# EAGLE design IFM_DuberFilter_ThroughHole_PCB_REV1 (EAGLE 9.5.1)
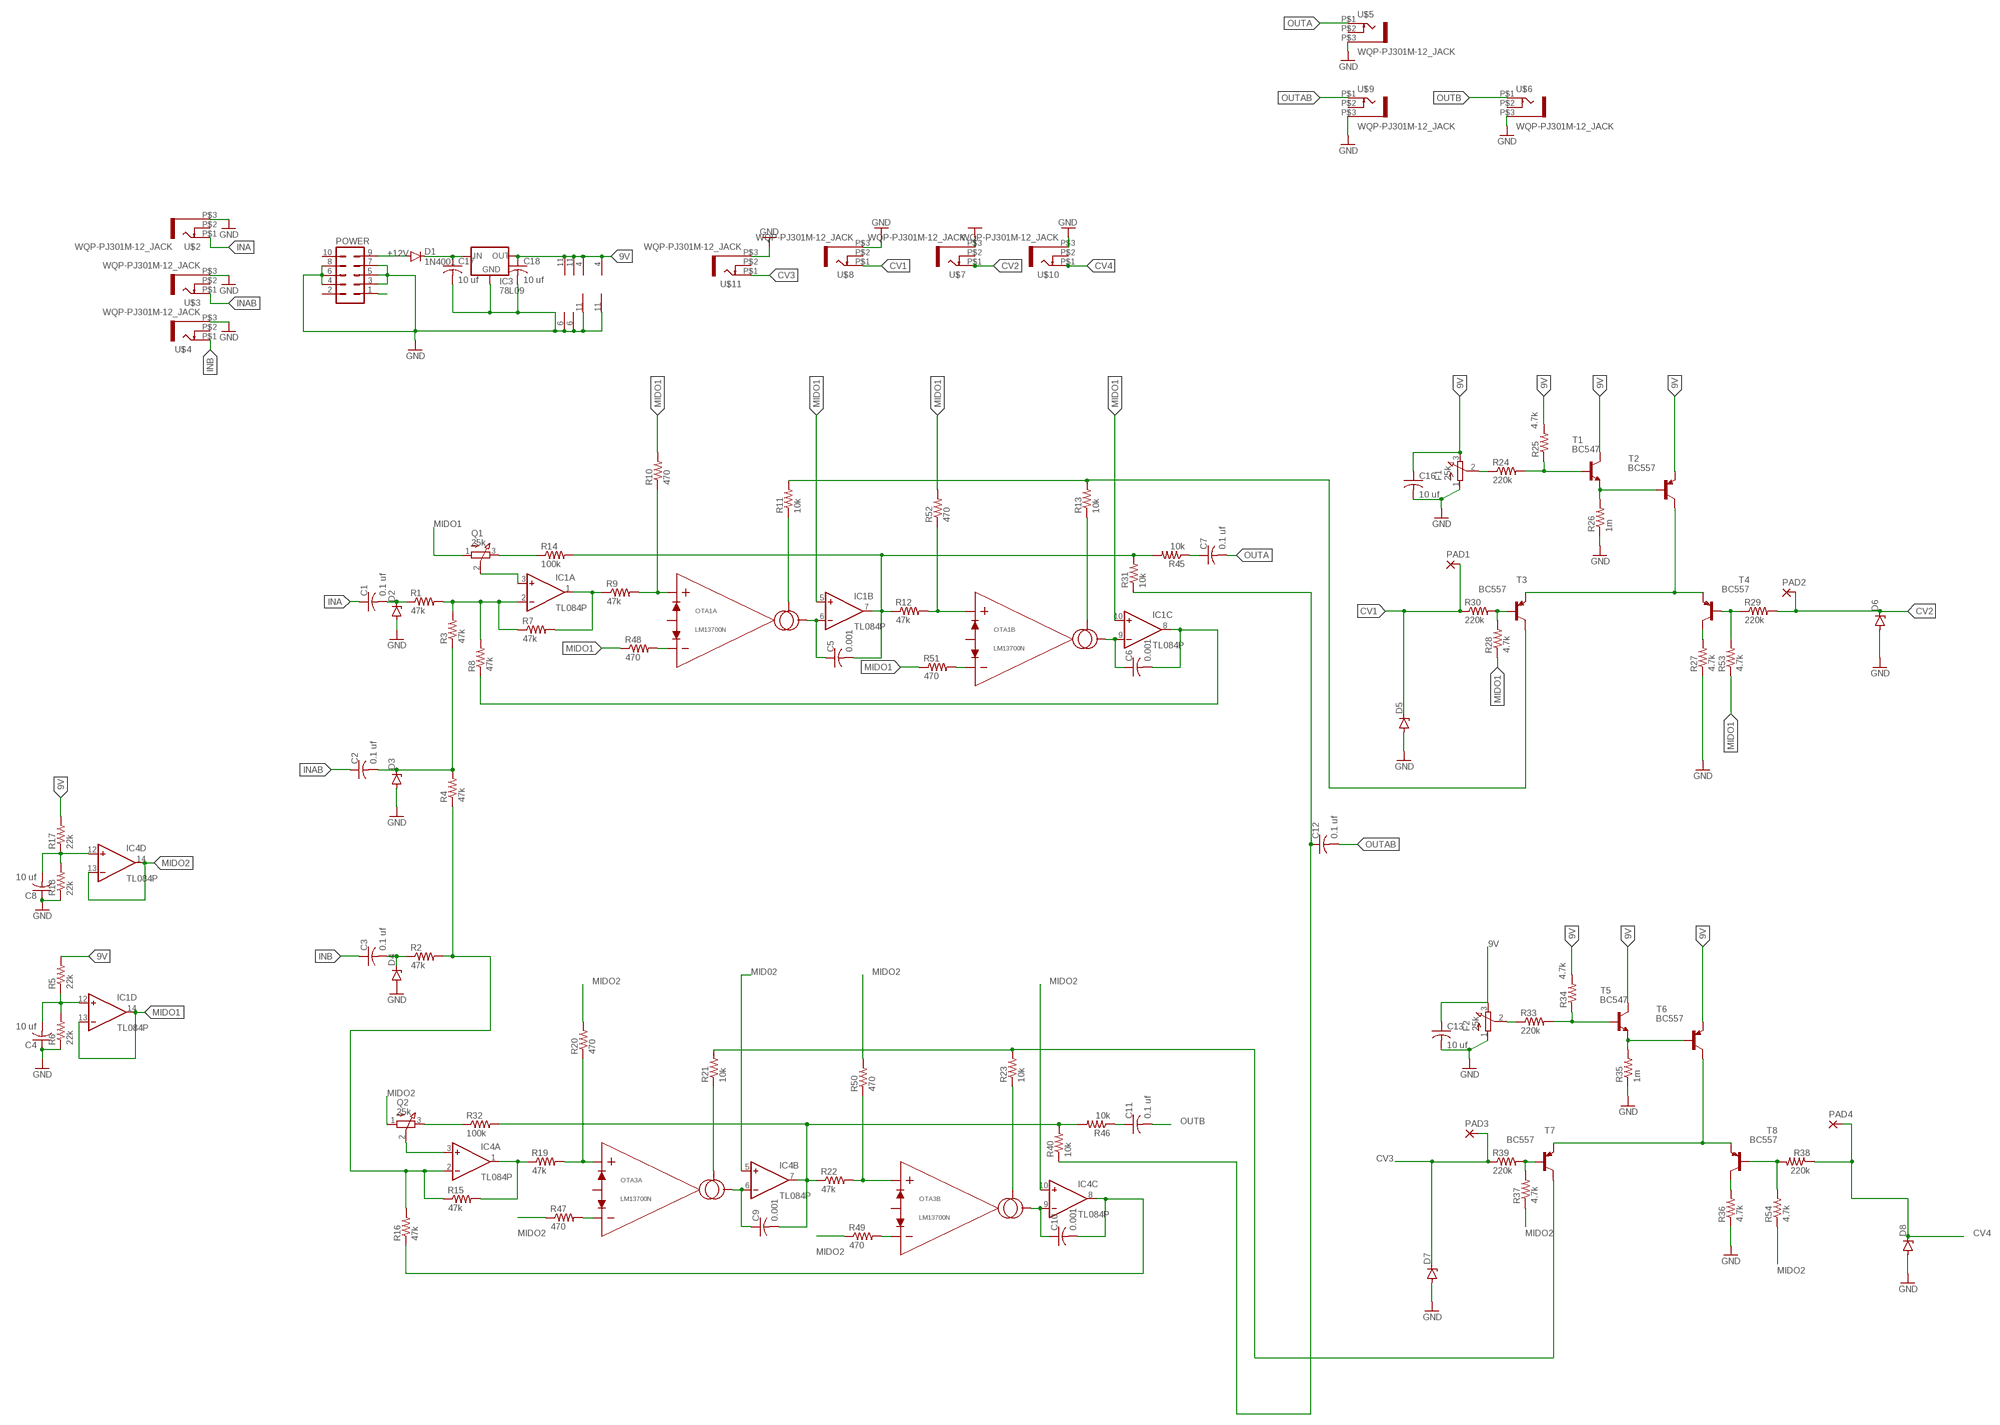
[diagram p0: schematic, sheet 1]

## Parts
C1  0.1 uf  C-US050-030X075  [C050-030X075]
C2  0.1 uf  C-US050-030X075  [C050-030X075]
C3  0.1 uf  C-US050-030X075  [C050-030X075]
C4  10 uf  C-US050-030X075  [C050-030X075]
C5  0.001  C-US050-030X075  [C050-030X075]
C6  0.001  C-US050-030X075  [C050-030X075]
C7  0.1 uf  C-US050-030X075  [C050-030X075]
C8  10 uf  C-US050-030X075  [C050-030X075]
C9  0.001  C-US050-030X075  [C050-030X075]
C10  0.001  C-US050-030X075  [C050-030X075]
C11  0.1 uf  C-US050-030X075  [C050-030X075]
C12  0.1 uf  C-US050-030X075  [C050-030X075]
C13  10 uf  C-US050-030X075  [C050-030X075]
C16  10 uf  C-US050-030X075  [C050-030X075]
C17  10 uf  C-US050-030X075  [C050-030X075]
C18  10 uf  C-US050-030X075  [C050-030X075]
D1  1N4001  1N4004  [DO41-10]
D2  ZENER-DIODEDO34-7  [DO34Z7]
D3  ZENER-DIODEDO34-7  [DO34Z7]
D4  ZENER-DIODEDO34-7  [DO34Z7]
D5  ZENER-DIODEDO34-7  [DO34Z7]
D6  ZENER-DIODEDO34-7  [DO34Z7]
D7  ZENER-DIODEDO34-7  [DO34Z7]
D8  ZENER-DIODEDO34-7  [DO34Z7]
F1  25k  EVUF3L  [EVUFXL]
F2  25k  EVUF3L  [EVUFXL]
IC1  TL084P  [DIL14]
IC3  78L09  78LXX  [78LXX]
IC4  TL084P  [DIL14]
OTA1  LM13700N  [DIP16]
OTA3  LM13700N  [DIP16]
PAD1  SMD2  [SMD1,27-2,54]
PAD2  SMD2  [SMD1,27-2,54]
PAD3  SMD2  [SMD1,27-2,54]
PAD4  SMD2  [SMD1,27-2,54]
POWER  10_PIN_HEADER  [MA05-2]
Q1  25k  EVUF3L  [EVUFXL]
Q2  25k  EVUF3L  [EVUFXL]
R1  47k  R-US_0204/7  [0204/7]
R2  47k  R-US_0204/7  [0204/7]
R3  47k  R-US_0204/7  [0204/7]
R4  47k  R-US_0204/7  [0204/7]
R5  22k  R-US_0204/7  [0204/7]
R6  22k  R-US_0204/7  [0204/7]
R7  47k  R-US_0204/7  [0204/7]
R8  47k  R-US_0204/7  [0204/7]
R9  47k  R-US_0204/7  [0204/7]
R10  470  R-US_0204/7  [0204/7]
R11  10k  R-US_0204/7  [0204/7]
R12  47k  R-US_0204/7  [0204/7]
R13  10k  R-US_0204/7  [0204/7]
R14  100k  R-US_0204/7  [0204/7]
R15  47k  R-US_0204/7  [0204/7]
R16  47k  R-US_0204/7  [0204/7]
R17  22k  R-US_0204/7  [0204/7]
R18  22k  R-US_0204/7  [0204/7]
R19  47k  R-US_0204/7  [0204/7]
R20  470  R-US_0204/7  [0204/7]
R21  10k  R-US_0204/7  [0204/7]
R22  47k  R-US_0204/7  [0204/7]
R23  10k  R-US_0204/7  [0204/7]
R24  220k  R-US_0204/7  [0204/7]
R25  4.7k  R-US_0204/7  [0204/7]
R26  1m  R-US_0204/7  [0204/7]
R27  4.7k  R-US_0204/7  [0204/7]
R28  4.7k  R-US_0204/7  [0204/7]
R29  220k  R-US_0204/7  [0204/7]
R30  220k  R-US_0204/7  [0204/7]
R31  10k  R-US_0204/7  [0204/7]
R32  100k  R-US_0204/7  [0204/7]
R33  220k  R-US_0204/7  [0204/7]
R34  4.7k  R-US_0204/7  [0204/7]
R35  1m  R-US_0204/7  [0204/7]
R36  4.7k  R-US_0204/7  [0204/7]
R37  4.7k  R-US_0204/7  [0204/7]
R38  220k  R-US_0204/7  [0204/7]
R39  220k  R-US_0204/7  [0204/7]
R40  10k  R-US_0204/7  [0204/7]
R45  10k  R-US_0204/7  [0204/7]
R46  10k  R-US_0204/7  [0204/7]
R47  470  R-US_0204/7  [0204/7]
R48  470  R-US_0204/7  [0204/7]
R49  470  R-US_0204/7  [0204/7]
R50  470  R-US_0204/7  [0204/7]
R51  470  R-US_0204/7  [0204/7]
R52  470  R-US_0204/7  [0204/7]
R53  4.7k  R-US_0204/7  [0204/7]
R54  4.7k  R-US_0204/7  [0204/7]
T1  BC547  [TO92]
T2  BC557  BC557A-PNP-TO92-EBC  [TO92-EBC]
T3  BC557  BC557A-PNP-TO92-EBC  [TO92-EBC]
T4  BC557  BC557A-PNP-TO92-EBC  [TO92-EBC]
T5  BC547  [TO92]
T6  BC557  BC557A-PNP-TO92-EBC  [TO92-EBC]
T7  BC557  BC557A-PNP-TO92-EBC  [TO92-EBC]
T8  BC557  BC557A-PNP-TO92-EBC  [TO92-EBC]
U$2  WQP-PJ301M-12_JACK  [WQP-PJ301M-12_JACK]
U$3  WQP-PJ301M-12_JACK  [WQP-PJ301M-12_JACK]
U$4  WQP-PJ301M-12_JACK  [WQP-PJ301M-12_JACK]
U$5  WQP-PJ301M-12_JACK  [WQP-PJ301M-12_JACK]
U$6  WQP-PJ301M-12_JACK  [WQP-PJ301M-12_JACK]
U$7  WQP-PJ301M-12_JACK  [WQP-PJ301M-12_JACK]
U$8  WQP-PJ301M-12_JACK  [WQP-PJ301M-12_JACK]
U$9  WQP-PJ301M-12_JACK  [WQP-PJ301M-12_JACK]
U$10  WQP-PJ301M-12_JACK  [WQP-PJ301M-12_JACK]
U$11  WQP-PJ301M-12_JACK  [WQP-PJ301M-12_JACK]

## Nets
9V: C13.1 C16.1 C18.1 F1.3(E) F2.3(E) IC1.4(P:V+) IC3.OUT IC4.4(P:V+) OTA1.11(PWR:VCC) OTA3.11(PWR:VCC) R5.2 R17.2 R25.2 R34.2 T1.3(C) T2.E T5.3(C) T6.E
+12V [power]: C17.1 D1.C IC3.IN
-12V [power]: POWER.1
CV1: D5.C PAD1.1(P) R30.1 U$8.P$1
CV2: D6.C PAD2.1(P) R29.2 U$7.P$1
CV3: D7.C PAD3.1(P) R39.1 U$11.P$1
CV4: D8.C PAD4.1(P) R38.1 U$10.P$1
GND: C4.1 C8.1 C13.2 C16.2 C17.2 C18.2 D2.A D3.A D4.A D5.A D6.A D7.A D8.A F1.1(A) F2.1(A) IC1.11(P:V-) IC3.GND IC4.11(P:V-) OTA1.6(PWR:VEE) OTA3.6(PWR:VEE) POWER.3 POWER.4 POWER.5 POWER.6 POWER.7 POWER.8 R6.1 R18.1 R26.1 R27.1 R35.1 R36.1 U$2.P$3 U$3.P$3 U$4.P$3 U$5.P$3 U$6.P$3 U$7.P$3 U$8.P$3 U$9.P$3 U$10.P$3 U$11.P$3
INA: C1.1 U$2.P$1
INAB: C2.1 U$3.P$1
INB: C3.1 U$4.P$1
MID02: IC4.5(B:+IN)
MIDO1: IC1.5(B:+IN) IC1.10(C:+IN) IC1.13(D:-IN) IC1.14(D:OUT) Q1.1(A) R10.2 R28.1 R48.1 R51.1 R52.2 R53.1
MIDO2: IC4.10(C:+IN) IC4.13(D:-IN) IC4.14(D:OUT) Q2.1(A) R20.2 R37.1 R47.1 R49.1 R50.2 R54.1
N$1: C3.2 D4.C R2.1
N$2: C1.2 D2.C R1.1
N$3: C2.2 D3.C R3.1 R4.2
N$4: IC4.2(A:-IN) R2.2 R4.1 R15.1 R16.2
N$5: IC1.2(A:-IN) R1.2 R3.2 R7.1 R8.2
N$6: OTA1.16(B:IABC) R13.1
N$7: C4.2 IC1.12(D:+IN) R5.1 R6.2
N$8: Q1.3(E) R14.1
N$9: OTA1.13(B:IN-) R51.2
N$10: IC4.1(A:OUT) R15.2 R19.1
N$11: IC1.1(A:OUT) R7.2 R9.1
N$12: OTA1.3(A:IN+) R9.2 R10.1
N$13: C5.1 IC1.6(B:-IN) OTA1.5(A:IOUT)
N$14: OTA1.1(A:IABC) R11.1
N$15: C5.2 IC1.7(B:OUT) R12.1 R14.2 R31.2 R45.2
N$16: R29.1 R53.2 T4.B
N$17: R11.2 R13.2 T3.C
N$18: C6.1 IC1.9(C:-IN) OTA1.12(B:IOUT)
N$19: C6.2 IC1.8(C:OUT) R8.1
N$20: IC1.3(A:+IN) Q1.2(S)
N$21: F1.2(S) R24.1
N$22: OTA1.14(B:IN+) R12.2 R52.1
N$23: OTA3.3(A:IN+) R19.2 R20.1
N$24: C8.2 IC4.12(D:+IN) R17.1 R18.2
N$25: C9.1 IC4.6(B:-IN) OTA3.5(A:IOUT)
N$26: OTA3.1(A:IABC) R21.1
N$27: C9.2 IC4.7(B:OUT) R22.1 R32.2 R40.2 R46.2
N$28: OTA3.16(B:IABC) R23.1
N$29: R21.2 R23.2 T7.C
N$30: Q2.3(E) R32.1
N$31: C10.1 IC4.9(C:-IN) OTA3.12(B:IOUT)
N$32: C10.2 IC4.8(C:OUT) R16.1
N$33: D1.A POWER.9
N$34: IC4.3(A:+IN) Q2.2(S)
N$35: OTA1.4(A:IN-) R48.2
N$36: R33.2 R34.1 T5.2(B)
N$37: F2.2(S) R33.1
N$38: R24.2 R25.1 T1.2(B)
N$40: R26.2 T1.1(E) T2.B
N$41: T2.C T3.E T4.E
N$42: R35.2 T5.1(E) T6.B
N$43: R27.2 T4.C
N$44: C12.1 R31.1 R40.1
N$45: R28.2 R30.2 T3.B
N$47: C11.1 R46.1
N$50: T6.C T7.E T8.E
N$51: R36.2 T8.C
N$52: R38.2 R54.2 T8.B
N$53: R37.2 R39.2 T7.B
N$55: OTA3.4(A:IN-) R47.2
N$56: OTA3.13(B:IN-) R49.2
N$57: OTA3.14(B:IN+) R22.2 R50.1
N$66: C7.1 R45.1
OUTA: C7.2 U$5.P$1
OUTAB: C12.2 U$9.P$1
OUTB: C11.2 U$6.P$1
Unconnected: OTA1.2(A:BIAS) OTA1.7(BUFA:IN) OTA1.8(BUFA:OUT) OTA1.9(BUFB:OUT) OTA1.10(BUFB:IN) OTA1.15(B:BIAS) OTA3.2(A:BIAS) OTA3.7(BUFA:IN) OTA3.8(BUFA:OUT) OTA3.9(BUFB:OUT) OTA3.10(BUFB:IN) OTA3.15(B:BIAS) POWER.2 POWER.10 U$2.P$2 U$3.P$2 U$4.P$2 U$5.P$2 U$6.P$2 U$7.P$2 U$8.P$2 U$9.P$2 U$10.P$2 U$11.P$2

## Library data of the parts
C1-C13 C16-C18 = rcl:C-US: CAPACITOR, American symbol; SPICEPREFIX: C
D1 = diode:1N4004: DIODE general purpose rectifier, 1 A
D2 D4-D8 = diode:ZENER-DIODE: Z-Diode
D3 = diode:ZENER-DIODE: Z-Diode; SPICEPREFIX: D
F1 F2 Q1 Q2 = pot:EVU: 9 mm Square Rotary Potentiometers Source: Panasonic
IC1 IC4 = linear:TL084: OP AMP
IC3 = v-reg:78LXX: VOLTAGE REGULATOR
OTA1 OTA3 = OTAs:LM13700: Dual OTA with linearizing diode and output buffers - 2MHz open-loop bandwidth - Linearizing diodes reduces distortion at higher differential input voltages - Darlington output buffers enables low-impedance output LM13700 or LM13600 The LM13700 differs from the LM13600 in that the 13700's output buffers are biased independently from the transconductance amplifier, allowing superior performance in audio applications. Originally released by National Semiconductor Manufactured by Texas Instruments.
PAD1-PAD4 = wirepad:SMD2: SMD PAD
POWER = TomW:10_PIN_HEADER: PIN HEADER; OC_FARNELL: unknown; OC_NEWARK: unknown
R1-R40 R45-R54 = rcl:R-US_: RESISTOR, American symbol; SPICEPREFIX: R
T1 T5 = transistor:BC547: NPN TRANSISTOR
T2-T4 T6-T8 = transistor:*-PNP-: PNP Transistror
U$2-U$11 = thonkiconn:WQP-PJ301M-12_JACK

## Net classes
1 power: width 0.61 mm

## Board
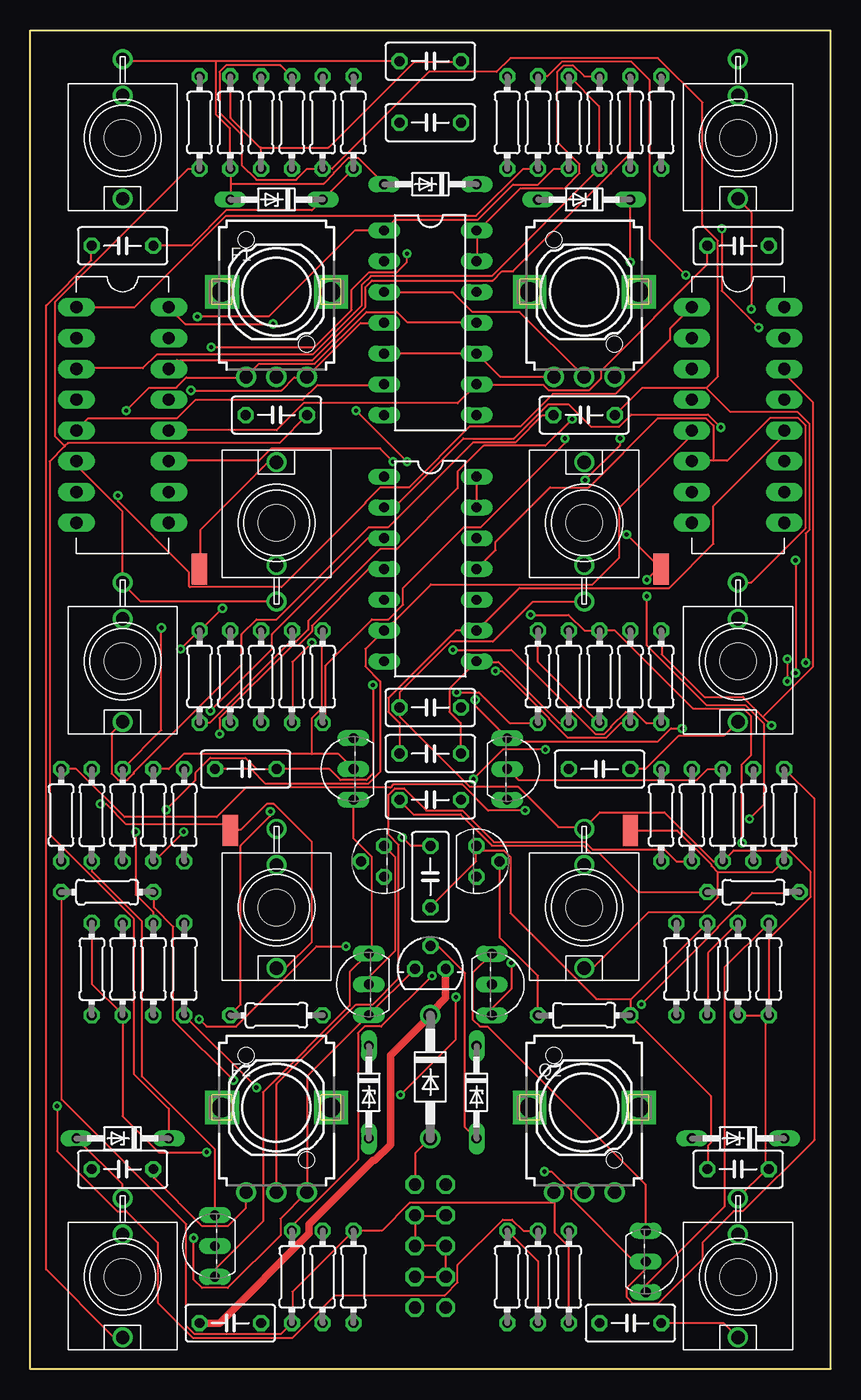
[diagram p1: board, top side]
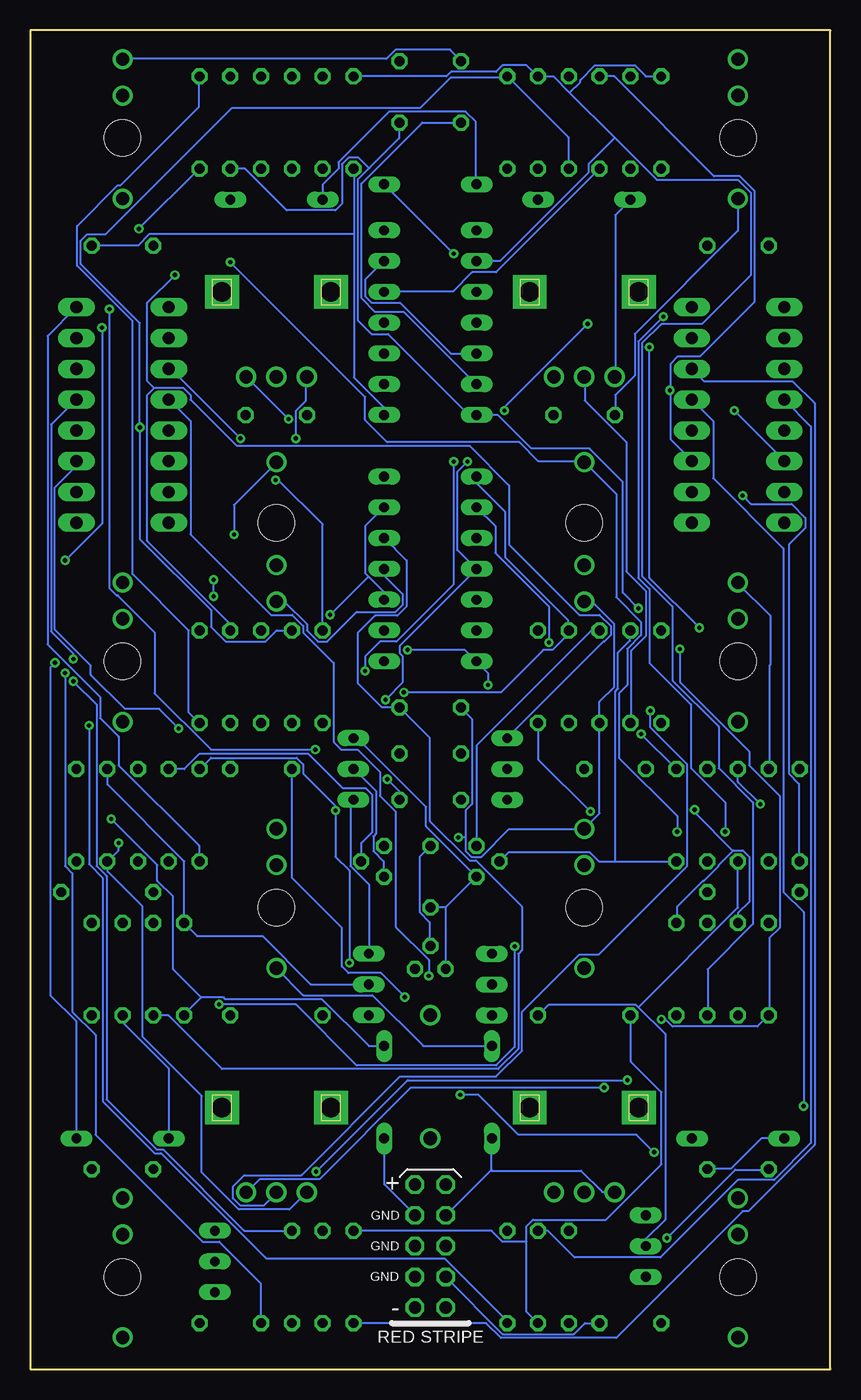
[diagram p2: board, bottom side, seen from below]

Size 66.04 x 110.49 mm. Coordinates in mm from the lower left corner, seen from the top.
Outline: 0,110.49 66.04,110.49 66.04,0 0,0 0,110.49
Copper layers (1*16): Top 0.035mm / dielectric 1.5mm / Bottom 0.035mm
Design rules "default": minimum track width 6mil, minimum drill 0.35mm, track to track 6mil, track to pad 6mil, pad to pad 6mil, via to via 6mil, smd to smd 6mil, copper to edge 40mil, drill to drill 6mil, minimum pad ring 10mil, minimum via ring 8mil, stop-mask expansion 4mil, vias tented up to drill 0mil, thermal gap 10mil
Holes 3 mm at 7.62,101.6 20.32,69.85 7.62,7.62 7.62,58.42 20.32,38.1 45.72,69.85 45.72,38.1 58.42,7.62 58.42,58.42 58.42,101.6

### Footprints (pad centres in the part's own frame; a part is rotated, then mirrored left to right if it is on the bottom)
C050-030X075 = drill 0.813 octagon: 1 -2.54,0; 2 2.54,0
DO41-10 = drill 1.118: A 5.08,0; C -5.08,0
DO34Z7 = drill 0.813 long: A 3.81,0; C -3.81,0
EVUFXL = drill 1.1 pad 1.676: 1 -2.5,-7; 2 0,-7; 3 2.5,-7 | drill 1.6 pad 2.8 square: M1 4.5,0; M2 -4.5,0
DIL14 = drill 0.813 long: 1 -7.62,-3.81; 2 -5.08,-3.81; 3 -2.54,-3.81; 4 0,-3.81; 5 2.54,-3.81; 6 5.08,-3.81; 7 7.62,-3.81; 8 7.62,3.81; 9 5.08,3.81; 10 2.54,3.81; 11 0,3.81; 12 -2.54,3.81; 13 -5.08,3.81; 14 -7.62,3.81
78LXX = drill 0.813 octagon: GND 0,1.905; IN 1.27,0; OUT -1.27,0
DIP16 = drill 1 long: 1 -3.81,0; 2 -3.81,-2.54; 3 -3.81,-5.08; 4 -3.81,-7.62; 5 -3.81,-10.16; 6 -3.81,-12.7; 7 -3.81,-15.24; 8 -3.81,-17.78; 9 3.81,-17.78; 10 3.81,-15.24; 11 3.81,-12.7; 12 3.81,-10.16; 13 3.81,-7.62; 14 3.81,-5.08; 15 3.81,-2.54; 16 3.81,0
SMD1,27-2,54 = smd 1.27 x 2.54: 1 0,0
MA05-2 = drill 1.016 octagon: 1 -5.08,-1.27; 2 -5.08,1.27; 3 -2.54,-1.27; 4 -2.54,1.27; 5 0,-1.27; 6 0,1.27; 7 2.54,-1.27; 8 2.54,1.27; 9 5.08,-1.27; 10 5.08,1.27
0204/7 = drill 0.813 octagon: 1 -3.81,0; 2 3.81,0
TO92 = drill 0.813 octagon: 1 1.27,0; 2 0,1.905; 3 -1.27,0
TO92-EBC = drill 0.813 long: B 0,-1.27; C 2.54,-1.27; E -2.54,-1.27
WQP-PJ301M-12_JACK = drill 1.1: P$1 0,5; P$2 0,-3.5; P$3 0,-6.5

### Placement (x,y rotation side)
C1  20.32,78.74 0 top
C2  45.72,78.74 0 top
C3  7.62,92.71 0 top
C4  33.02,107.95 0 top
C5  33.02,102.87 0 top
C6  58.42,92.71 0 top
C7  33.02,46.99 0 top
C8  33.02,54.61 0 top
C9  17.78,49.53 0 top
C10  33.02,50.8 0 top
C11  49.53,3.81 0 top
C12  46.99,49.53 0 top
C13  58.42,16.51 0 top
C16  7.62,16.51 0 top
C17  16.51,3.81 0 top
C18  33.02,40.64 90 top
D1  33.02,24.13 270 top
D2  7.62,19.05 180 top
D3  58.42,19.05 180 top
D4  20.32,96.52 180 top
D5  45.72,96.52 180 top
D6  33.02,97.79 180 top
D7  36.83,22.86 270 top
D8  27.94,22.86 270 top
F1  20.32,88.9 0 top
F2  20.32,21.59 0 top
IC1  33.02,86.36 270 top
IC3  33.02,33.02 0 top
IC4  33.02,66.04 270 top
OTA1  7.62,87.63 0 top
OTA3  58.42,87.63 0 top
PAD1  13.97,66.04 0 top
PAD2  16.51,44.45 0 top
PAD3  52.07,66.04 0 top
PAD4  49.53,44.45 0 top
POWER  33.02,10.16 90 bottom
Q1  45.72,88.9 0 top
Q2  45.72,21.59 0 top
R1  13.97,102.87 90 top
R2  26.67,102.87 90 top
R3  24.13,102.87 90 top
R4  21.59,102.87 90 top
R5  19.05,102.87 90 top
R6  16.51,102.87 90 top
R7  10.16,33.02 90 top
R8  39.37,102.87 90 top
R9  44.45,102.87 90 top
R10  46.99,102.87 90 top
R11  41.91,102.87 90 top
R12  49.53,102.87 90 top
R13  49.53,57.15 90 top
R14  13.97,57.15 90 top
R15  21.59,57.15 90 top
R16  44.45,57.15 90 top
R17  55.88,33.02 90 top
R18  58.42,33.02 90 top
R19  41.91,57.15 90 top
R20  46.99,57.15 90 top
R21  2.54,45.72 90 top
R22  52.07,57.15 90 top
R23  52.07,45.72 90 top
R24  16.51,57.15 90 top
R25  12.7,45.72 90 top
R26  19.05,57.15 90 top
R27  5.08,45.72 270 top
R28  24.13,57.15 90 top
R29  7.62,45.72 90 top
R30  10.16,45.72 90 top
R31  5.08,33.02 270 top
R32  12.7,33.02 90 top
R33  54.61,45.72 90 top
R34  45.72,29.21 0 top
R35  57.15,45.72 90 top
R36  60.96,33.02 90 top
R37  59.69,45.72 90 top
R38  62.23,45.72 90 top
R39  53.34,33.02 90 top
R40  7.62,33.02 90 top
R45  59.69,39.37 0 top
R46  52.07,102.87 90 top
R47  21.59,7.62 90 top
R48  24.13,7.62 90 top
R49  44.45,7.62 90 top
R50  26.67,7.62 90 top
R51  41.91,7.62 90 top
R52  39.37,7.62 90 top
R53  20.32,29.21 0 top
R54  6.35,39.37 0 top
T1  29.21,41.91 90 top
T2  26.67,31.75 90 top
T3  25.4,49.53 90 top
T4  13.97,10.16 90 top
T5  36.83,41.91 270 top
T6  40.64,49.53 270 top
T7  39.37,31.75 270 top
T8  52.07,8.89 270 top
U$2  7.62,101.6 180 top
U$3  7.62,58.42 180 top
U$4  7.62,7.62 180 top
U$5  58.42,101.6 180 top
U$6  58.42,7.62 180 top
U$7  20.32,38.1 180 top
U$8  20.32,69.85 0 top
U$9  58.42,58.42 180 top
U$10  45.72,38.1 180 top
U$11  45.72,69.85 0 top

### Tracks (layer width: path | path; a pad name or v marks a point on that pad's centre or on a via)
9V  (via drill 0.35)
  Top 0.152: IC1.4 29.18,86.33 27.28,86.33 22.86,81.92 F1.3 22.78,81.84 21.79,81.84 20.73,80.77 v13.26,80.77 | v15.62,52.43 15.62,53.72 21.64,59.74 22.1,59.74 23.24,60.88 23.24,61.34 27.89,65.99 29.18,65.99 IC4.4 | R17.2 49.57,30.52 | 49.57,30.52 49.53,30.48 R34.2 49.53,29.18 56.16,22.55 56.16,18.67 55.93,18.44 55.93,16.54 C13.1 | v13.49,10.82 13.49,7.39 14.17,6.71 16.31,6.71 20.65,11.05 20.65,12.42 22.78,14.55 F2.3 22.86,14.63 22.86,24.16 27.89,29.18 T2.E 27.96,29.26 31.7,32.99 IC3.OUT | 36.8,42.82 36.8,41.91 32.99,38.1 C18.1 | 36.8,42.82 36.8,43.13 T5.3 36.8,42.82 | v53.8,52.88 52.88,52.88 51.82,51.82 39.62,51.82 T6.E 36.73,54.71 v36.73,55.24 | 36.8,42.82 39.09,42.82 39.62,42.29 39.62,37.64 46.71,30.56 49.53,30.56 49.57,30.52 | v29.95,74.91 28.88,75.97 19.89,75.97 18.9,74.98 11.43,74.98 OTA1.11
  Bottom 0.152: R5.2 17.83,106.68 9.6,98.45 7.47,98.45 6.25,97.23 6.25,88.09 10.74,83.59 12.57,83.59 13.18,82.98 13.18,80.77 | 13.18,80.77 13.18,76.73 11.43,74.98 OTA1.11 | 13.18,80.77 v13.26,80.77 | v15.62,52.43 12.72,49.53 R25.2 | v13.49,10.82 7.85,16.46 5.11,16.46 C16.1 | 31.77,38.1 C18.1 | 31.77,38.1 29.26,40.62 T1.3 33.38,44.81 33.38,46.41 39.01,52.05 39.32,52.05 T6.E | v53.8,52.88 55.4,54.48 58.22,54.48 61.04,57.3 61.04,58.06 64.01,61.04 64.01,72.77 62.26,74.52 62.26,74.91 OTA3.11 | 31.77,38.1 31.77,33.07 IC3.OUT | v36.73,55.24 35.28,56.69 35.28,58.83 35.51,59.05 35.51,59.74 IC4.4 29.26,66.06 30.79,67.59 30.79,74.07 v29.95,74.91
+12V
  Top 0.61: C17.1 15.62,3.81 23.01,11.2 23.01,11.96 28.27,17.22 28.42,17.22 29.72,18.52 29.72,25.91 D1.C 33.15,29.49 34.29,30.63 IC3.IN
CV1  (via drill 0.35)
  Top 0.152: PAD1.1 14.02,66.06 14.02,69.27 19.58,74.83 20.27,74.83 U$8.P$1 | v12.65,44.35 10.21,41.91 R30.1 | v49.53,91.36 D5.C
  Bottom 0.152: v12.65,44.35 12.65,45.64 17.45,50.44 17.45,55.78 16.76,56.46 16.76,59.44 15.62,60.58 15.62,61.65 17.68,63.7 17.68,72.24 20.27,74.83 U$8.P$1 20.34,74.91 24.08,74.91 25.68,76.5 36.58,76.5 38.41,78.33 38.41,80.24 v49.53,91.36
CV2  (via drill 0.35)
  Top 0.152: U$7.P$1 20.34,33.15 21.11,33.15 23.24,35.28 23.24,43.51 20.12,46.63 19.51,46.63 17.37,44.5 16.54,44.5 PAD2.1 16,44.96 7.92,44.96 6.25,46.63 v5.79,46.63 | v31.09,92.05 31.09,91.36 30.25,90.53 27.96,90.53 26.52,89.08 26.52,87.4 23.47,84.35 v14.94,84.35 | v10.82,61.19 10.82,52.73 R29.2
  Bottom 0.152: R29.2 7.62,48.46 v5.79,46.63 | v31.09,92.05 D6.C | v14.94,84.35 14.94,65.3 v10.82,61.19
CV3  (via drill 0.35)
  Top 0.152: v49.23,68.89 PAD3.1 51.89,66.14 v50.9,65.15 | v50.9,63.78 50.9,59.74 55.85,54.79 59.05,54.79 60.58,53.26 60.58,46.63 v59.36,45.41
  Bottom 0.152: v49.23,68.89 49.23,71.32 45.72,74.83 U$11.P$1 | D7.C 38.1,26.67 41.99,30.56 49.99,30.56 50.14,30.71 51.89,30.71 51.93,30.67 | 51.93,30.67 53.34,29.26 R39.1 | v50.9,63.78 v50.9,65.15 | v59.36,45.41 55.55,41.6 55.55,40.31 54.25,39.01 54.25,32.99 51.93,30.67
CV4
  Top 0.152: 56.77,41 56.24,41.53 56.24,41.6 53.42,44.42 49.53,44.42 PAD4.1 | 56.77,41 61.27,41 62.18,41.91 R38.1 | 56.77,41 56.77,38.94 55.55,37.72 51.05,37.72 46.48,33.15 45.72,33.15 U$10.P$1
  Bottom 0.152: D8.C 33.6,26.67 37.8,30.86 43.51,30.86 45.72,33.07 U$10.P$1
GND  (via drill 0.35)
  Top 0.152: IC1.11 36.8,86.41 31.09,86.41 30.25,87.25 27.74,87.25 23.47,82.98 18.9,82.98 17.83,81.92 F1.1 17.75,81.84 12.88,81.84 12.04,81 9.83,81 v7.92,79.1 | 16.54,97.84 16.54,99.06 R6.1 16.46,99.06 16.46,102.41 15.32,103.56 15.32,107.97 | 16.54,97.84 16.54,96.55 D4.A | 16.54,97.84 24.23,97.84 25.07,98.68 25.07,98.75 26.29,99.97 27.05,99.97 29.18,97.84 D6.A | 15.32,107.97 7.7,107.97 7.62,108.05 U$2.P$3 | 15.32,107.97 30.48,107.97 C4.1 | IC3.GND 33.07,34.9 33.68,34.9 35.89,32.69 35.89,19.96 36.8,19.05 D7.A | POWER.3 POWER.4 POWER.6 34.29,10.21 31.85,10.21 POWER.5 31.77,10.21 31.77,12.65 POWER.7 31.85,12.65 34.29,12.65 POWER.8 | D2.A 7.62,15.24 U$4.P$3 | C16.2 10.21,16.46 10.21,15.77 14.17,11.81 16.31,11.81 17.75,13.26 17.75,14.55 F2.1 | OTA1.6 3.81,74.6 7.62,70.79 U$3.P$3 7.62,64.85 9.07,63.4 20.27,63.4 U$8.P$3 | U$6.P$3 58.45,14.17 60.73,16.46 60.96,16.46 C13.2 60.66,16.46 60.66,29.18 | 60.66,29.18 58.45,29.18 R18.1 | 60.66,29.18 60.96,29.18 R36.1 | 60.66,29.18 R36.1 | 56.39,74.98 57.53,74.98 61.04,78.49 63.4,78.49 64.01,77.88 64.01,69.42 59.51,64.92 58.45,64.92 U$9.P$3 | 56.39,74.98 54.63,74.98 OTA3.6 | U$11.P$3 45.72,63.32 41.45,63.32 38.18,60.05 34.67,60.05 30.48,55.85 C8.1 30.48,53.87 36.27,48.08 40.23,48.08 43.59,44.73 45.72,44.73 U$10.P$3 45.72,44.65 47.02,45.95 52.35,45.95 56.39,41.91 R35.1 58.06,42.82 62.64,42.82 64.39,41.07 64.39,38.94 60.96,35.51 R36.1 | 56.39,74.98 56.39,77.88 55.78,78.49 51.82,78.49 46.1,72.77 42.9,72.77 38.41,68.28 38.41,67.59 36.88,66.06 IC4.11 | v30.71,43.89 31.39,43.2 32.99,43.2 C18.2
  Bottom 0.152: D5.A 41.91,97.77 40.62,99.06 40.62,99.59 36.42,103.78 30.1,103.78 29.26,102.95 29.26,97.84 D6.A | F1.1 17.75,81.92 17.75,95.25 16.54,96.47 D4.A | U$5.P$3 58.37,108.13 36.65,108.13 35.89,108.89 31.39,108.89 30.48,107.97 C4.1 | C18.2 33.91,42.29 33.91,37.72 33.07,36.88 33.07,34.98 IC3.GND | D7.A 36.8,19.05 36.8,15.24 34.29,12.72 POWER.8 | C17.2 20.27,3.81 21.18,2.9 27.05,2.9 31.77,7.62 POWER.3 | D2.A 5.71,19.05 8.23,16.54 10.13,16.54 C16.2 | 28,16.42 31.7,12.72 POWER.7 | 28,16.42 27.96,16.46 27.96,19.05 D8.A | F2.1 17.83,14.63 18.82,14.63 20.57,16.38 27.96,16.38 28,16.42 | U$8.P$3 20.27,63.32 19.66,63.32 17.83,61.49 17.83,56.31 19.05,55.09 R26.1 19.05,45.87 20.27,44.65 U$7.P$3 20.34,44.58 26.52,44.58 28.8,42.29 29.64,42.29 30.1,42.75 30.1,43.89 | R27.1 5.03,49.53 5.03,58.06 4.95,58.14 4.95,62.18 7.62,64.85 U$3.P$3 | D3.A 54.63,19.05 54.63,24.84 58.37,28.57 58.37,29.18 R18.1 | IC4.11 36.8,65.99 36.8,65.46 35.28,63.93 35.28,63.09 35.89,62.48 39.09,62.48 41.53,60.05 42.29,60.05 43.2,60.96 43.2,61.49 45.03,63.32 45.72,63.32 U$11.P$3 | 30.1,43.89 30.1,46.1 29.57,46.63 29.57,53.65 30.48,54.56 C8.1 | 30.1,43.89 v30.71,43.89 | v7.92,79.1 3.81,74.98 OTA1.6
INA
  Bottom 0.152: U$2.P$1 7.62,93.95 16.15,85.42 16.15,81.99 17.75,80.39 17.75,78.79 C1.1
INAB
  Top 0.152: C2.1 43.13,78.72 42.29,78.72 40.08,76.5 36.58,76.5 29.57,69.49 27.96,69.49 20.34,61.87 18.67,61.87 17.45,60.66 17.45,58.14 8.53,49.23 8.53,49.15 8,48.62 7.24,48.62 6.71,49.15 6.71,52.5 U$3.P$1
INB
  Top 0.152: C3.1 5.03,92.66 5.03,91.52 1.29,87.78 1.29,8.23 6.86,2.67 7.62,2.67 U$4.P$1
MIDO1  (via drill 0.35)
  Top 0.152: IC1.5 IC1.10 36.88,83.82 38.79,81.92 43.2,81.92 Q1.1 | IC1.13 36.88,91.44 36.88,93.95 IC1.14 36.96,93.95 40.46,97.46 44.12,97.46 45.34,98.68 45.34,99.44 43.51,101.27 43.51,107.06 44.04,107.59 44.81,107.59 45.72,106.68 R10.2 | R51.1 41.91,8.91 39.4,11.43 R52.2 | v19.81,46.02 19.81,45.64 17.37,43.2 17.37,30.1 16.54,29.26 R53.1 | v44.12,76.81 44.12,76.43 37.19,69.49 35.81,69.49 30.79,64.47 30.79,63.09 29.57,61.87 28.19,61.87 24.38,58.06 24.38,53.57 24.16,53.34 R28.1
  Bottom 0.152: IC1.5 31.32,83.82 35.51,88.01 37.87,88.01 38.41,88.54 38.41,89.92 36.88,91.44 IC1.13 | 25.07,10.52 25.07,4.72 24.16,3.81 R48.1 | 25.07,10.52 25.07,11.81 24.54,12.34 18.52,12.34 13.95,16.92 13.95,22.86 16.46,25.38 16.46,29.18 R53.1 | v19.81,46.02 24.08,50.29 24.08,53.34 R28.1 | R52.2 27.96,11.43 27.05,10.52 25.07,10.52 | v44.12,76.81 44.12,79.1 43.28,79.93 43.28,81.84 Q1.1
MIDO2  (via drill 0.35)
  Top 0.152: R54.1 2.59,39.32 2.59,22.25 12.88,11.96 12.88,3.58 13.56,2.9 20.65,2.9 21.57,3.81 R47.1 21.64,3.81 21.64,6.4 R50.2 29.03,11.43 31.32,13.72 43.28,13.72 | v41.3,62.26 44.42,62.26 45.72,60.96 R20.2 48.23,60.96 54.71,54.48 58.9,54.48 59.51,53.87 59.51,50.67 58.75,49.91 v58.75,43.43 | IC4.14 36.88,73.61 36.88,71.17 IC4.13 | 43.28,13.72 43.28,14.55 Q2.1 | 43.28,13.72 43.28,11.28 44.42,10.13 44.42,3.81 R49.1
  Bottom 0.152: 38.14,65.42 38.41,65.68 38.41,69.57 36.88,71.09 IC4.13 | 38.14,65.42 36.88,64.16 36.88,63.55 IC4.10 | 38.14,65.42 v41.3,62.26 | 59.66,41.91 59.66,41.07 56.77,38.18 56.77,27.43 51.89,22.55 51.89,16.23 48.84,13.18 44.65,13.18 43.28,14.55 Q2.1 | v58.75,43.43 58.75,42.82 59.66,41.91 | 59.66,41.91 R37.1
N$1
  Top 0.152: C3.2 10.21,92.73 13.26,92.73 16.15,95.63 23.24,95.63 D4.C R2.1
N$2
  Top 0.152: D2.C 11.43,21.49 8.53,24.38 8.53,37.19 1.6,44.12 1.6,74.91 2.86,76.16 | 2.86,76.16 3.12,76.43 20.57,76.43 22.86,78.72 C1.2 | R1.1 13.03,99.06 2.06,88.09 2.06,76.96 2.86,76.16
N$3  (via drill 0.35)
  Top 0.152: R4.2 21.57,106.68 20.65,107.59 16.15,107.59 15.62,107.06 15.62,103.71 17.45,101.88 17.45,99.36 18.67,98.15 21.95,98.15 22.86,99.06 R3.1 24.92,99.06 32.92,107.06 38.48,107.06 39.62,108.2 51.82,108.2 55.47,104.55 55.47,94.41 56.77,93.12 56.77,81.92 55.82,80.96 | v64.01,58.29 64.01,68.96 64.31,69.27 64.31,78.03 63.32,79.02 57.76,79.02 55.82,80.96 | 55.82,80.96 55.78,81 50.52,81 C2.2
  Bottom 0.152: v64.01,58.29 64.39,57.91 64.39,30.86 62.26,28.73 62.26,19.05 D3.C
N$4  (via drill 0.35)
  Top 0.152: v23.24,59.97 21.64,58.37 21.64,53.34 R15.1 | v57,77.72 55.93,78.79 49.61,78.79 48.62,77.8 46.25,77.8 44.42,79.63 42.75,79.63 39.93,76.81 35.74,76.81 30.1,71.17 29.26,71.17 IC4.2
  Bottom 0.152: R4.1 21.64,99.06 21.64,101.65 R2.2 26.67,106.6 31.32,106.6 33.83,104.09 49.38,104.09 59.82,93.65 61.34,93.65 61.87,93.12 61.87,91.21 57,86.33 v57,77.72 57,68.5 51.13,62.64 51.13,61.27 49.91,60.05 46.63,60.05 45.72,60.96 R16.2 | v23.24,59.97 23.24,62.94 27.66,67.36 27.66,69.57 IC4.2
N$5
  Bottom 0.152: 21.53,105.35 22.86,106.68 R3.2 24.16,106.68 25.07,107.59 27.05,107.59 27.58,107.06 31.32,107.06 31.7,106.68 R8.2 | 21.53,105.35 17.79,101.61 | 17.79,101.61 14.33,98.15 7.62,98.15 6.55,97.08 6.55,90.3 10.59,86.26 13.95,86.26 15.54,84.66 15.54,65.46 13.03,62.94 13.03,56.84 9.22,53.03 9.22,49.61 6.4,46.79 6.4,36.73 10.13,32.99 10.13,29.26 R7.1 | IC1.2 27.28,91.44 19.96,98.75 19.96,99.44 17.79,101.61 | R1.2 15.24,106.68 16.15,107.59 19.43,107.59 20.65,106.38 20.65,106.22 21.53,105.35
N$6  (via drill 0.35)
  Top 0.152: R13.1 48.77,53.34 47.55,52.12 44.35,52.12 42.82,53.65 42.82,53.72 38.94,57.61 v38.41,57.61 | v26.9,79.1 v31.09,74.91 | v20.04,86.26 12.8,86.26 OTA1.16
  Bottom 0.152: v38.41,57.61 38.41,58.83 37.19,60.05 35.81,60.05 31.09,64.77 v31.09,74.91 | v26.9,79.1 26.9,79.4 v20.04,86.26
N$7
  Top 0.152: 19.01,100.78 19.05,100.74 R5.1 | 19.01,100.78 16.54,103.25 16.54,106.68 R6.2 | C4.2 35.51,107.9 31.7,107.9 24.61,100.81 19.05,100.81 19.01,100.78
  Bottom 0.152: R5.1 27.58,90.53 29.57,90.53 31.17,88.92 36.8,88.92 IC1.12
N$8  (via drill 0.35)
  Top 0.152: R14.1 14.78,53.34 21.49,60.05 21.95,60.05 22.94,61.04 22.94,61.72 28.88,67.67 30.25,67.67 35.28,72.69 35.28,74.07 37.41,76.2 42.52,76.2 v44.73,78.41
  Bottom 0.152: v44.73,78.41 48.16,81.84 Q1.3
N$9  (via drill 0.35)
  Top 0.152: R51.2 40.69,11.43 39.78,12.34 39.01,12.34 35.28,8.61 35.28,7.16 34.21,6.1 25.15,6.1 21.64,2.59 13.41,2.59 10.52,5.49 10.52,10.44 7.92,13.03 7.16,13.03 2.21,17.98 v2.21,21.72
  Bottom 0.152: v2.21,21.72 2.21,37.72 3.89,39.4 3.89,67.74 9.68,73.53 9.68,78.26 OTA1.13
N$10  (via drill 0.35)
  Top 0.152: R19.1 39.55,53.34 37.03,55.85 v35.2,55.85
  Bottom 0.152: v35.2,55.85 27.2,55.85 23.7,59.36 22.94,59.36 21.64,60.66 21.64,60.96 | 21.64,60.96 21.64,61.8 26.82,66.98 26.82,70.71 29.18,73.08 29.18,73.61 IC4.1 | 21.64,60.96 R15.2
N$11  (via drill 0.35)
  Top 0.152: v8.69,44.35 8.69,39.17 10.13,37.72 10.13,36.88 R7.2 | v13.79,86.87 19.66,86.87 26.75,93.95 29.18,93.95 IC1.1 30.1,94.87 36.96,94.87 39.85,97.77 41.91,97.77 43.2,99.06 R9.1
  Bottom 0.152: v8.69,44.35 8.69,46.79 11.51,49.61 11.51,54.86 14.94,58.29 14.94,64.39 15.85,65.3 15.85,84.81 v13.79,86.87
N$12
  Top 0.152: 46.94,99.06 46.94,104.24 44.5,106.68 R9.2 | 46.94,99.06 38.1,90.22 28.12,90.22 27.36,89.46 27.36,87.78 23.32,83.74 10.44,83.74 9.3,82.6 3.81,82.6 OTA1.3 | 46.94,99.06 R10.1
N$13
  Top 0.152: IC1.6 29.18,81.23 23.7,81.23 22.48,80.01 13.64,80.01 12.12,78.49 4.8,78.49 3.81,77.5 OTA1.5
  Bottom 0.152: C5.1 33.68,102.87 38.71,97.84 38.71,88.39 37.57,87.25 35.2,87.25 29.26,81.31 IC1.6
N$14
  Top 0.152: R11.1 40.69,99.06 36.8,95.17 16.15,95.17 8.61,87.63 OTA1.1
N$15  (via drill 0.35)
  Top 0.152: v12.42,59.44 13.95,60.96 R14.2 14.02,60.96 v15.85,62.79 | v50.44,30.1 56.77,36.42 56.77,36.5 59.59,39.32 63.48,39.32 R45.2 | v26.06,34.9 23.62,34.9 16.99,28.27 14.55,28.27 v13.95,28.88
  Bottom 0.152: 38.06,99.1 35.59,101.58 35.59,102.87 C5.2 | 38.06,99.1 39.01,98.15 39.01,86.56 37.87,85.42 36.5,85.42 29.87,78.79 29.26,78.79 IC1.7 29.18,78.72 27.43,78.72 24.69,75.97 19.89,75.97 17.14,73.23 17.14,64.08 v15.85,62.79 | R12.1 48.31,99.06 44.88,95.63 40.84,95.63 40.31,96.16 40.31,99.44 39.78,99.97 38.94,99.97 38.06,99.1 | v12.42,59.44 12.42,56.69 6.71,50.98 6.71,49.84 4.19,47.32 4.19,36.42 5.03,35.59 5.03,29.26 R31.2 6.02,28.27 13.03,28.27 13.64,28.88 v13.95,28.88 | v50.44,30.1 44.12,30.1 39.09,25.07 27.58,25.07 26.06,26.59 v26.06,34.9
N$16
  Bottom 0.152: T4.B 15.24,10.74 13.64,12.34 13.64,27.66 15.85,29.87 | 15.85,29.87 16.08,30.1 23.24,30.1 R53.2 | R29.1 7.62,38.1 15.85,29.87
N$17  (via drill 0.35)
  Top 0.152: R11.2 42.67,106.68 43.89,107.9 49.61,107.9 51.13,106.38 51.13,93.27 v54.1,90.3
  Bottom 0.152: 55.82,80.96 56.39,80.39 56.39,68.35 49.53,61.49 R13.2 | 55.82,80.96 55.78,81 53.42,81 52.81,80.39 52.81,80.01 49,76.2 29.79,76.2 26.52,72.92 26.52,68.05 20.73,62.26 19.05,62.26 18.14,61.34 18.14,60.58 18.67,60.05 18.75,60.05 26.67,52.12 T3.C | v54.1,90.3 56.39,88.01 56.39,81.53 55.82,80.96
N$18
  Top 0.152: C6.1 55.85,92.66 55.85,91.14 47.09,82.37 47.09,81.76 46.1,80.77 42.82,80.77 42.37,81.23 36.88,81.23 IC1.9 36.8,81.23 35.28,79.7 22.55,79.7 20.34,77.5 11.43,77.5 OTA1.12
N$19
  Bottom 0.152: 39.32,93.65 39.32,99.06 R8.1 | 39.32,93.65 39.32,81.84 36.88,79.4 36.88,78.79 IC1.8 | 39.32,93.65 56.24,93.65 57.15,92.73 60.96,92.73 C6.2
N$20
  Top 0.152: IC1.3 29.26,88.85 34.9,88.85 36.5,87.25 40.39,87.25 45.72,81.92 Q1.2
N$21
  Bottom 0.152: R24.1 16.46,53.34 16.46,59.28 15.24,60.5 15.24,64.24 16.84,65.84 16.84,76.5 20.27,79.93 20.27,81.84 F1.2
N$22
  Top 0.152: R12.2 49.53,100.36 47.93,98.75 47.93,98.68 39.85,90.6 38.94,90.6 38.18,89.84 28.19,89.84 27.66,89.31 27.66,87.63 23.32,83.29 12.12,83.29 11.43,82.6 OTA1.14
  Bottom 0.152: R52.1 28.42,3.81 27.2,2.59 17.68,2.59 7.24,13.03 6.78,13.03 1.29,18.52 1.29,79.7 3.12,81.53 10.44,81.53 11.43,82.53 OTA1.14
N$23  (via drill 0.35)
  Top 0.152: R19.2 41.91,58.37 46.94,53.34 R20.1 | v48.69,76.81 48.69,76.28 v45.8,73.38
  Bottom 0.152: v48.69,76.81 54.41,82.53 54.56,82.53 OTA3.3 | v45.8,73.38 45.57,73.38 41.91,69.72 R19.2
N$24
  Top 0.152: R17.1 55.93,29.26 55.93,34.37 58.37,36.8 R18.2
  Bottom 0.152: IC4.12 36.8,68.58 34.98,66.75 34.98,62.94 35.74,62.18 37.57,62.18 39.01,60.73 39.01,56.62 37.03,54.63 35.59,54.63 C8.2 33.07,52.12 33.07,45.26 29.79,41.99 29.26,41.99 25.45,38.18 25.45,34.59 25.76,34.29 25.76,26.44 27.43,24.77 50.22,24.77 54.63,29.18 55.85,29.18 R17.1
N$25
  Top 0.152: C9.1 18.21,49.53 19.43,48.31 27.89,48.31 28.88,49.3 28.88,56.77 27.66,57.99 27.66,59.44 29.18,60.96 IC4.6 29.26,60.96 33.07,64.77 46.41,64.77 48.62,66.98 48.62,71.09 54.56,77.04 54.56,77.42 OTA3.5
N$26  (via drill 0.35)
  Top 0.152: v7.24,72.08 7.24,71.63 13.11,65.76 13.11,64.62 13.18,64.54 20.73,64.54 27.66,71.48 27.66,71.55 28.88,72.77 31.24,72.77 36.27,77.8 40.46,77.8 43.13,80.47 48.31,80.47 52.81,84.96 52.81,85.88 54.56,87.63 OTA3.1
  Bottom 0.152: v7.24,72.08 6.55,71.4 3.2,71.4 2.06,70.26 2.06,69.42 3.43,68.05 3.43,49.15 2.59,48.31 2.59,41.91 R21.1
N$27  (via drill 0.35)
  Top 0.152: v11.2,46.18 13.64,48.62 13.64,49.23 14.86,50.44 17.75,50.44 18.67,49.53 C9.2 24.69,49.53 25.6,48.62 27.74,48.62 28.27,49.15 v28.27,56.46 | R22.1 50.83,53.34 49.91,54.25 49.15,54.25 47.93,53.03 47.93,52.96 47.4,52.43 46.63,52.43 39.7,59.36 v34.9,59.36
  Bottom 0.152: R40.2 7.62,37.64 6.71,38.56 6.71,42.29 7.24,42.82 8,42.82 8.04,42.79 | 8.04,42.79 9.22,41.6 9.22,41.53 10.44,40.31 10.52,40.31 12.65,38.18 12.65,36.88 R32.2 | v11.2,46.18 11.2,45.95 8.04,42.79 | v34.9,59.36 30.18,59.36 29.26,58.45 IC4.7 29.18,58.37 28.27,57.45 v28.27,56.46 | R46.2 52.12,106.68 52.12,104.17 58.6,97.69 58.83,97.69 62.18,94.34 62.18,91.06 57.61,86.49 57.61,65.61 52.96,60.96 52.96,54.18 52.12,53.34 R22.1
N$28
  Bottom 0.152: R23.1 52.12,41.91 52.12,43.2 58.75,49.84 58.75,52.2 60.27,53.72 60.27,55.47 64.62,59.82 64.62,85.27 62.26,87.63 OTA3.16
N$29  (via drill 0.35)
  Top 0.152: R21.2 3.81,49.53 7.77,45.57 15.39,45.57 17.83,48.01 29.72,48.01 29.95,48.23 35.66,48.23 37.8,46.1 v40.84,46.1 | T7.C 38.1,29.79 39.7,31.39 v39.7,33.53
  Bottom 0.152: R23.2 52.05,49.53 51.13,50.44 44.04,50.44 43.51,49.91 43.51,49.15 40.84,46.48 v40.84,46.1 40.84,42.29 39.7,41.15 v39.7,33.53
N$30  (via drill 0.35)
  Top 0.152: v18.67,23.24 R32.1
  Bottom 0.152: v18.67,23.24 34.59,23.24 42.14,15.7 47.09,15.7 48.16,14.63 Q2.3
N$31
  Top 0.152: C10.1 30.48,53.34 29.57,54.25 29.57,55.4 35.13,60.96 IC4.9 36.88,60.96 40.39,64.47 52.73,64.47 56.39,68.12 56.39,71.25 62.18,77.04 62.18,77.42 OTA3.12
N$32
  Top 0.152: C10.2 35.51,50.83 35.51,53.34 34.59,54.25 34.59,56.16 36.8,58.37 IC4.8 36.88,58.37 38.63,58.37 43.66,53.34 R16.1
N$33
  Top 0.152: POWER.9 31.77,15.24 31.77,17.83 32.99,19.05 D1.A
N$34  (via drill 0.35)
  Top 0.152: IC4.3 27.89,68.58 19.96,60.66 19.96,59.44 v14.86,54.33
  Bottom 0.152: v14.86,54.33 14.86,52.96 11.81,49.91 11.81,41.53 19.13,34.21 20.73,34.21 25.45,29.49 25.45,26.29 27.58,24.16 35.51,24.16 43.66,16 48.39,16 49.3,15.09 49.3,14.1 48.69,13.49 46.79,13.49 45.72,14.55 Q2.2
N$35
  Bottom 0.152: R48.2 23.32,11.43 21.11,9.22 14.02,9.22 7.62,15.62 4.65,15.62 1.6,18.67 1.6,77.8 OTA1.4
N$36
  Top 0.152: R34.1 41.91,32.46 38.79,35.59 38.79,41.91 T5.2
  Bottom 0.152: R33.2 53.34,49.53 52.12,50.75 43.05,50.75 40.23,47.93 38.33,47.93 37.8,47.4 37.8,44.35 38.71,43.43 38.71,41.91 T5.2
N$37
  Top 0.152: R33.1 53.34,41.91 52.35,42.9 46.41,42.9 45.8,43.51 38.25,43.51 35.66,46.1 32.69,46.1 30.86,47.93 30.1,47.93 29.57,47.4 29.57,44.12 30.4,43.28 30.4,32.23 28.27,30.1 26.9,30.1 20.34,23.55 20.34,14.63 F2.2
N$38
  Bottom 0.152: 17.75,41.91 19.13,41.91 19.89,42.67 26.52,42.67 27.28,41.91 T1.2 | 17.75,41.91 R25.1 | 17.75,41.91 17.75,55.93 17.53,56.16 17.53,59.13 16.54,60.12 16.54,60.96 R24.2
N$40
  Top 0.152: T1.1 30.1,42.29 30.1,34.52 27.96,32.38 27.96,31.77 T2.B
  Bottom 0.152: R26.2 19.74,60.96 29.18,51.51 29.18,43.2 T1.1
N$41
  Top 0.152: T4.E 15.24,8.23 19.2,12.19 19.2,22.86 26.36,30.02 26.36,32.77 27.89,34.29 T2.C 27.96,34.29 28.19,34.52 28.19,42.29 26.67,43.81 T3.E
N$42
  Top 0.152: R35.2 55.93,49.53 55.02,48.62 40.31,48.62 39.4,49.53 T6.B
  Bottom 0.152: T5.1 36.88,40.69 36.88,41.91 37.72,42.75 37.72,43.97 37.49,44.2 37.49,47.7 39.32,49.53 T6.B
N$43
  Top 0.152: T4.C 15.24,18.14 9.22,24.16 9.22,36.96 5.11,41.07 5.11,41.91 R27.2
N$44  (via drill 0.35)
  Top 0.152: R31.1 5.11,36.8 5.11,31.77 7.62,29.26 R40.1 7.62,20.88 10.59,17.91 v14.55,17.91 | v35.13,30.71 35.13,27.2 v30.56,22.63
  Bottom 0.152: v35.13,30.71 37.11,32.69 39.78,32.69 40.31,33.22 40.31,36.42 44.42,40.54 44.42,49.53 C12.1 | v30.56,22.63 29.03,22.63 25.76,19.36 16,19.36 v14.55,17.91
N$45
  Top 0.152: R30.2 11.43,49.53 12.65,50.75 23.24,50.75 | 23.24,50.75 25.45,50.75 T3.B | 23.24,50.75 23.24,53.72 24.08,54.56 24.08,60.96 R28.2
N$47  (via drill 0.35)
  Top 0.152: v63.17,66.75 v63.17,57.45 | v60.12,85.95 57.07,89 v57.07,94.11
  Bottom 0.152: v63.17,57.45 63.17,41.53 62.56,40.92 62.56,29.49 60.66,27.58 60.66,19.36 51.82,10.52 50.44,10.52 47.02,7.09 47.02,3.81 C11.1 | v63.17,66.75 60.12,69.8 v60.12,85.95 | v57.07,94.11 52.12,99.06 R46.1
N$50
  Top 0.152: T7.E 36.5,32.69 36.5,28.88 37.11,28.27 37.72,28.27 50.75,15.24 50.75,11.43 T8.E
  Bottom 0.152: T7.E 38.1,40.01 39.62,41.53 39.62,46.71 39.4,46.94 T6.C
N$51
  Top 0.152: T8.C 50.83,6.4 50.83,6.93 57.3,13.41 57.3,33.15 60.96,36.8 R36.2
N$52  (via drill 0.35)
  Top 0.152: R38.2 62.26,49.53 64.69,47.09 64.69,18.9 58.83,13.03 58.06,13.03 55.47,10.44 55.47,9.07 51.82,5.41 49.76,5.41 49.23,5.94 49.23,6.71 50.75,8.23 50.75,8.84 T8.B 50.75,8.91 49.84,8.91 44.65,14.1 44.65,14.71 43.05,16.31 v42.44,16.31 | v16.76,23.85 11.81,28.8 11.81,36.5 10.21,38.1 10.21,39.32 R54.2
  Bottom 0.152: v16.76,23.85 34.9,23.85 v42.44,16.31
N$53
  Bottom 0.152: T7.B 38.1,31.77 42.9,31.77 46.86,35.74 52.27,35.74 53.34,36.8 R39.2 53.34,41.91 59.66,48.23 59.66,49.53 R37.2
N$55  (via drill 0.35)
  Top 0.152: v33.15,32.46 28.96,28.27 27.58,28.27 27.05,27.74 27.05,17.3 21.64,11.89 21.64,11.43 R47.2
  Bottom 0.152: v33.15,32.46 33.15,33.76 35.89,36.5 35.89,46.02 37.19,47.32 37.19,49.3 39.01,51.13 40.39,51.13 41,51.74 41,58.29 43.51,60.81 43.51,61.34 44.42,62.26 46.18,62.26 52.81,68.89 52.81,78.26 54.56,80.01 OTA3.4
N$56  (via drill 0.35)
  Top 0.152: v62.48,58.6 v62.48,56.77
  Bottom 0.152: R49.2 48.39,11.43 55.09,18.14 55.63,18.14 59.74,22.25 59.74,40.69 60.58,41.53 60.58,54.86 v62.48,56.77 | v62.48,58.6 62.48,59.05 64.31,60.88 64.31,77.95 62.26,80.01 OTA3.13
N$57  (via drill 0.35)
  Top 0.152: 60.47,53.84 58.83,55.47 55.63,55.47 52.12,58.98 52.12,60.96 R22.2 | 60.47,53.84 v61.19,53.11 | 60.47,53.84 64.62,57.99 64.62,79.78 62.26,82.14 62.26,82.53 OTA3.14
  Bottom 0.152: R50.1 26.67,3.96 31.85,9.14 46.56,9.14 55.24,17.83 55.78,17.83 60.05,22.1 60.05,40.54 61.19,41.68 v61.19,53.11
N$66
  Top 0.152: R45.1 55.85,39.4 50.14,39.4 46.94,42.6 46.25,42.6 45.64,43.2 38.1,43.2 35.51,45.8 31.62,45.8 30.48,46.94 C7.1
OUTA  (via drill 0.35)
  Top 0.152: v36.58,48.69 39.01,51.13 v42.52,51.13 | v59.51,87.48 59.51,95.48 58.45,96.55 U$5.P$1
  Bottom 0.152: v36.58,48.69 35.59,47.7 35.59,47.02 C7.2 | v42.52,51.13 51.13,51.13 55.78,55.78 55.78,60.81 58.83,63.86 58.9,63.86 59.51,64.47 v59.51,87.48
OUTAB
  Top 0.152: C12.2 50.75,49.53 53.49,52.27 57.23,52.27 58.37,53.42 U$9.P$1
OUTB
  Top 0.152: C11.2 57.23,3.81 58.37,2.67 U$6.P$1